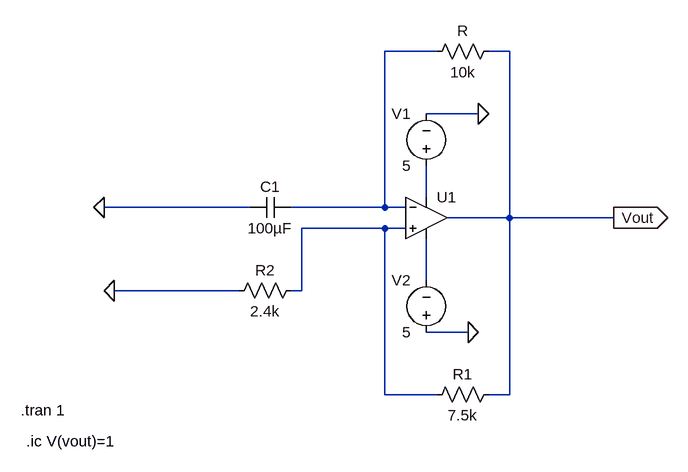
[diagram p0: schematic lab07.asc]
lab07.asc, the LTspice schematic file:
Version 4
SHEET 1 880 680
WIRE 496 48 416 48
WIRE 608 48 576 48
WIRE 560 144 480 144
WIRE 480 272 480 224
WIRE 208 288 -16 288
WIRE 416 288 416 48
WIRE 416 288 272 288
WIRE 448 288 416 288
WIRE 608 304 608 48
WIRE 608 304 512 304
WIRE 768 304 608 304
WIRE 416 320 288 320
WIRE 448 320 416 320
WIRE 480 400 480 336
WIRE 192 416 0 416
WIRE 288 416 288 320
WIRE 288 416 272 416
WIRE 544 480 480 480
WIRE 416 576 416 320
WIRE 496 576 416 576
WIRE 608 576 608 304
WIRE 608 576 576 576
FLAG -16 288 0
FLAG 0 416 0
FLAG 560 144 0
FLAG 544 480 0
FLAG 768 304 Vout
IOPIN 768 304 Out
SYMBOL res 592 560 R90
WINDOW 0 0 56 VBottom 2
WINDOW 3 32 56 VTop 2
SYMATTR InstName R1
SYMATTR Value 7.5k
SYMBOL res 592 32 R90
WINDOW 0 0 56 VBottom 2
WINDOW 3 32 56 VTop 2
SYMATTR InstName R
SYMATTR Value 10k
SYMBOL OpAmps/UniversalOpAmp2 480 304 R0
SYMATTR InstName U1
SYMBOL cap 272 272 R90
WINDOW 0 0 32 VBottom 2
WINDOW 3 32 32 VTop 2
SYMATTR InstName C1
SYMATTR Value 100µF
SYMBOL res 288 400 R90
WINDOW 0 0 56 VBottom 2
WINDOW 3 32 56 VTop 2
SYMATTR InstName R2
SYMATTR Value 2.4k
SYMBOL voltage 480 240 R180
WINDOW 0 24 96 Left 2
WINDOW 3 24 16 Left 2
SYMATTR InstName V1
SYMATTR Value 5
SYMBOL voltage 480 496 R180
WINDOW 0 24 96 Left 2
WINDOW 3 24 16 Left 2
SYMATTR InstName V2
SYMATTR Value 5
TEXT -144 600 Left 2 !.tran 1
TEXT -136 648 Left 2 !.ic V(vout)=1

The netlist it stands for:
* lab07.asc
R1 Vout N003 7.5k
R Vout N001 10k
XU1 N003 N001 N002 N004 Vout level2 Avol=1Meg GBW=10Meg Slew=10Meg Ilimit=25m Rail=0 Vos=0 En=0 Enk=0 In=0 Ink=0 Rin=500Meg  ; pins In+ In- V+ V- OUT
C1 N001 0 100µF
R2 N003 0 2.4k
V1 N002 0 5
V2 0 N004 5
.tran 1
.ic V(vout)=1
.lib UniversalOpAmp2.lib
.backanno
.end